# EAGLE design RS232- EIB_Router V1.0 (EAGLE 5.04)
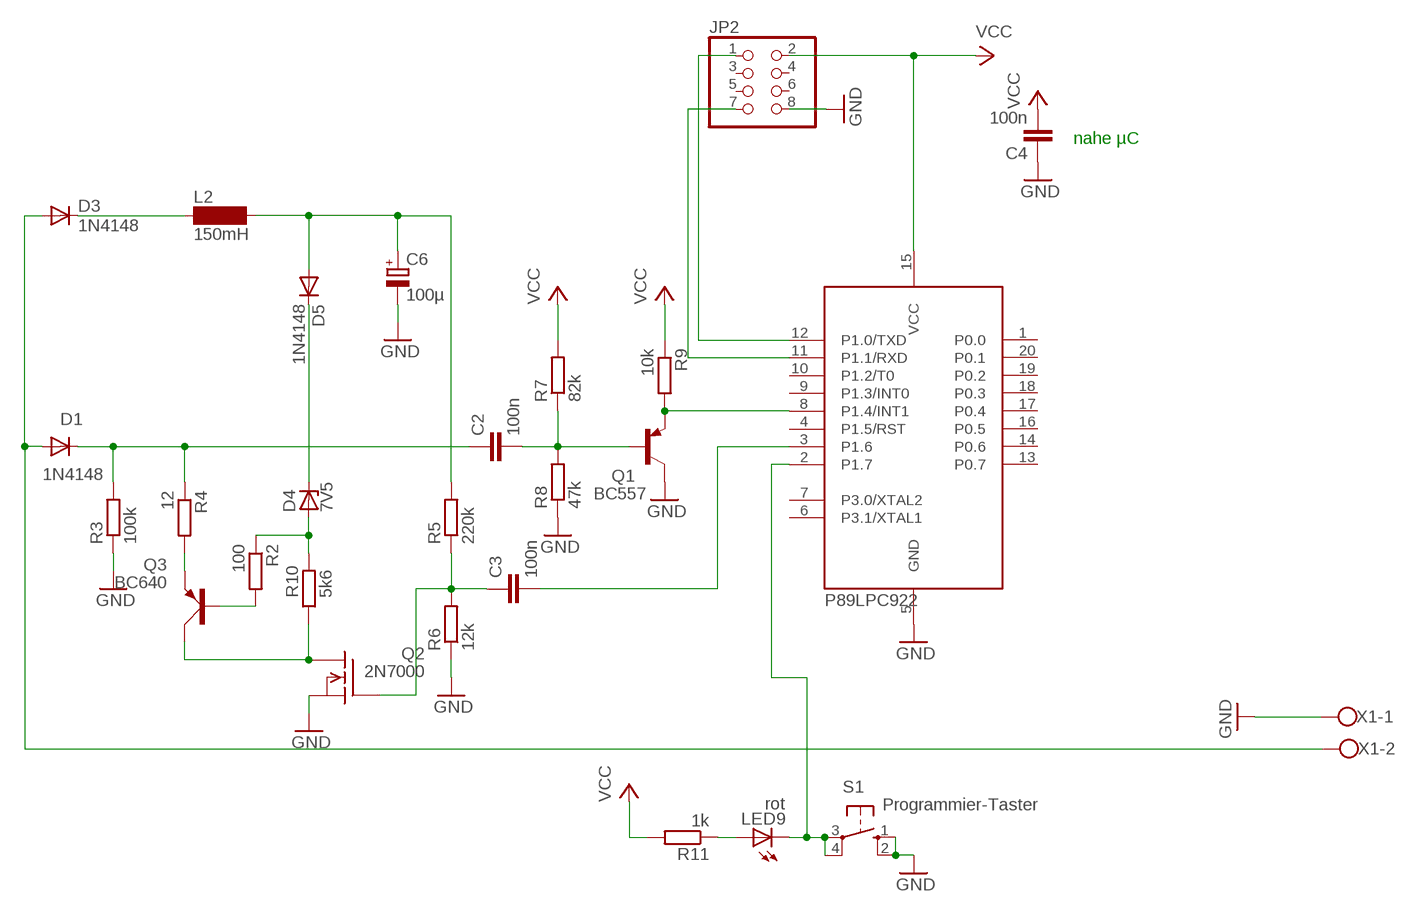
[diagram p0: schematic, sheet 1]

## Parts
C2  100n  C-EU050-024X044  [C050-024X044]
C3  100n  C-EU050-024X044  [C050-024X044]
C4  100n  C-EU050-024X044  [C050-024X044]
C6  100µ  CPOL-EUE5-8.5  [E5-8,5]
D1  1N4148  [DO35-10]
D3  1N4148  [DO35-10]
D4  7V5  ZPD  [DO35Z10]
D5  1N4148  [DO35-10]
JP2  PINHD-2X4  [2X04]
L2  150mH  SD12-1000  [SD12_1000]
LED9  rot  LED3MM  [LED3MM]
Q1  BC557  [TO92]
Q2  2N7000  VN2222KM  [TO237]
Q3  BC640  [SOT54D]
R2  100  R-EU_0207/10  [0207/10]
R3  100k  R-EU_0207/10  [0207/10]
R4  12  R-EU_0207/10  [0207/10]
R5  220k  R-EU_0207/10  [0207/10]
R6  12k  R-EU_0207/10  [0207/10]
R7  82k  R-EU_0207/10  [0207/10]
R8  47k  R-EU_0207/10  [0207/10]
R9  10k  R-EU_0207/10  [0207/10]
R10  5k6  R-EU_0207/10  [0207/10]
R11  1k  R-EU_0207/10  [0207/10]
S1  Programmier-Taster  10-XX  [B3F-10XX]
U1  89LPC922  [DIL20]
X1  W237-102  [W237-102]

## Nets
GND: C4.1 C6.- JP2.8 Q1.3(C) Q2.3(S) R3.1 R6.1 R8.1 S1.1(S) S1.2(S1) U1.5(GND) X1.1
N$1: Q1.1(E) R9.2 U1.8(P1.4/INT1)
N$2: C2.2 Q1.2(B) R7.1 R8.2
N$3: C6.+ D5.A L2.2 R5.2
N$5: C3.2 U1.3(P1.6)
N$6: Q2.1(D) Q3.C R10.1
N$8: D3.C L2.1
N$9: C2.1 D1.C R3.2 R4.1
N$11: D4.A R2.1 R10.2
N$12: Q3.E R4.2
N$14: Q3.B R2.2
N$16: D1.A D3.A X1.2
N$17: LED9.K(C) S1.3(P) S1.4(P1) U1.2(P1.7)
N$29: JP2.1 U1.12(P1.0/TXD)
N$30: JP2.7 U1.11(P1.1/RXD)
N$34: C3.1 Q2.2(G) R5.1 R6.2
N$40: D4.C D5.C
N$41: LED9.A R11.1
VCC: C4.2 JP2.2 R7.2 R9.1 R11.2 U1.15(VCC)
Unconnected: JP2.3 JP2.4 JP2.5 JP2.6 U1.1(P0.0) U1.4(P1.5/RST) U1.6(P3.1/XTAL1) U1.7(P3.0/XTAL2) U1.9(P1.3/INT0) U1.10(P1.2/T0) U1.13(P0.7) U1.14(P0.6) U1.16(P0.5) U1.17(P0.4) U1.18(P0.3) U1.19(P0.2) U1.20(P0.1)

## Notes on the sheet
- nahe µC
- P89LPC922

## Library data of the parts
C2-C4 = rcl:C-EU: CAPACITOR, European symbol
C6 = rcl:CPOL-EU: POLARIZED CAPACITOR, European symbol
D1 D3 D5 = diode:1N4148: DIODE high speed (Philips)
D4 = diode:ZPD: Z DIODE 500 mW
JP2 = pinhead:PINHD-2X4: PIN HEADER
L2 = inductor-neosid:SD12: INDUCTOR nominal inductance
LED9 = led:LED: LED OSRAM: - CHIPLED LG R971, LG N971, LY N971, LG Q971, LY Q971, LO R971, LY R971 LH N974, LH R974 LS Q976, LO Q976, LY Q976 LO Q996 - Hyper CHIPLED LW Q18S LB Q993, LB Q99A, LB R99A - SideLED LS A670, LO A670, LY A670, LG A670, LP A670 LB A673, LV A673, LT A673, LW A673 LH A674 LY A675 LS A676, LA A676, LO A676, LY A676, LW A676 LS A679, LY A679, LG A679 - Hyper Micro SIDELED® LS Y876, LA Y876, LO Y876, LY Y876 LT Y87S - SmartLED LW L88C, LW L88S LB L89C, LB L89S, LG L890 LS L89K, LO L89K, LY L89K LS L896, LA L896, LO L896, LY L896 - TOPLED LS T670, LO T670, LY T670, LG T670, LP T670 LSG T670, LSP T670, LSY T670, LOP T670, LYG T670 LG T671, LOG T671, LSG T671 LB T673, LV T673, LT T673, LW T673 LH T674 LS T676, LA T676, LO T676, LY T676, LB T676, LH T676, LSB T676, LW T676 LB T67C, LV T67C, LT T67C, LS T67K, LO T67K, LY T67K, LW E67C LS E67B, LA E67B, LO E67B, LY E67B, LB E67C, LV E67C, LT E67C LW T67C LS T679, LY T679, LG T679 LS T770, LO T770, LY T770, LG T770, LP T770 LB T773, LV T773, LT T773, LW T773 LH T774 LS E675, LA E675, LY E675, LS T675 LS T776, LA T776, LO T776, LY T776, LB T776 LHGB T686 LT T68C, LB T68C - Hyper Mini TOPLED® LB M676 - Mini TOPLED Santana® LG M470 LS M47K, LO M47K, LY M47K Source: http://www.osram.convergy.de - LUMILED® LXK2-PW12-R00, LXK2-PW12-S00, LXK2-PW14-U00, LXK2-PW14-V00 LXK2-PM12-R00, LXK2-PM12-S00, LXK2-PM14-U00 LXK2-PE12-Q00, LXK2-PE12-R00, LXK2-PE12-S00, LXK2-PE14-T00, LXK2-PE14-U00 LXK2-PB12-K00, LXK2-PB12-L00, LXK2-PB12-M00, LXK2-PB14-N00, LXK2-PB14-P00, LXK2-PB14-Q00 LXK2-PR12-L00, LXK2-PR12-M00, LXK2-PR14-Q00, LXK2-PR14-R00 LXK2-PD12-Q00, LXK2-PD12-R00, LXK2-PD12-S00 LXK2-PH12-R00, LXK2-PH12-S00 LXK2-PL12-P00, LXK2-PL12-Q00, LXK2-PL12-R00 Source: www.luxeon.com
Q1 = transistor-pnp:BC557: PNP Transistor
Q2 = transistor-fet:VN2222KM: N-Channel Enhancement MOSFET (VMOS); 60V; 0,5A; 7,5Ohm
Q3 = transistor-small-signal:BC640: PNP TRANSISTOR
R2-R11 = rcl:R-EU_: RESISTOR, European symbol
S1 = switch-omron:10-XX: OMRON SWITCH
U1 = micro-philips:89LPC922
X1 = con-wago-500:W237-102: WAGO SCREW CLAMP

## Board
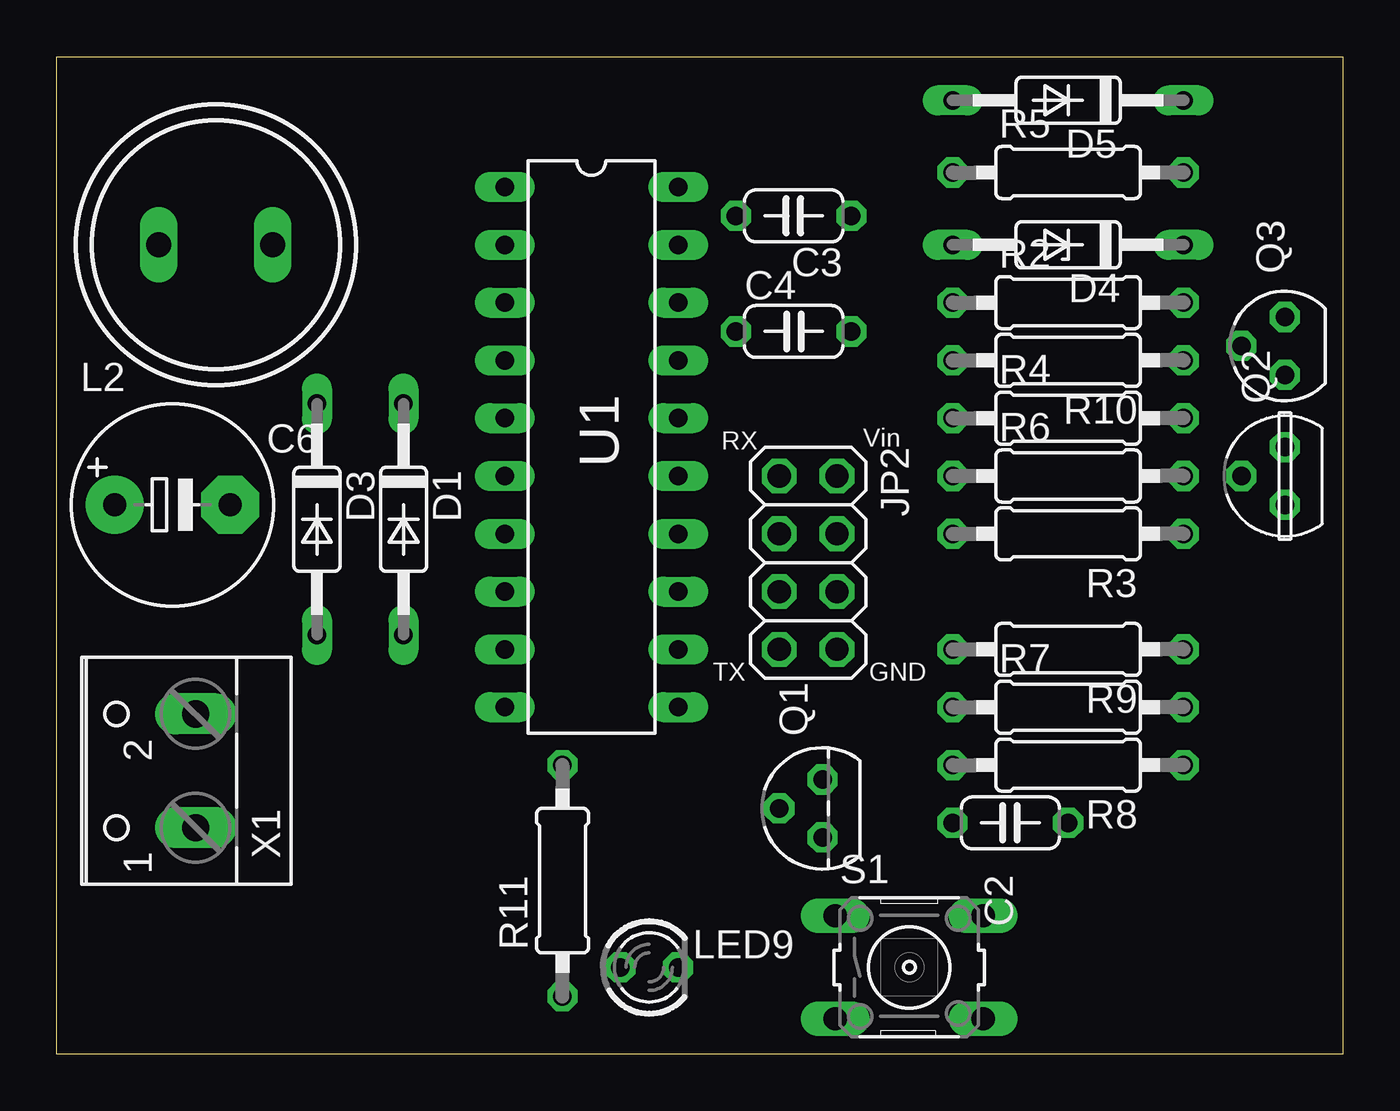
[diagram p1: board, top side]
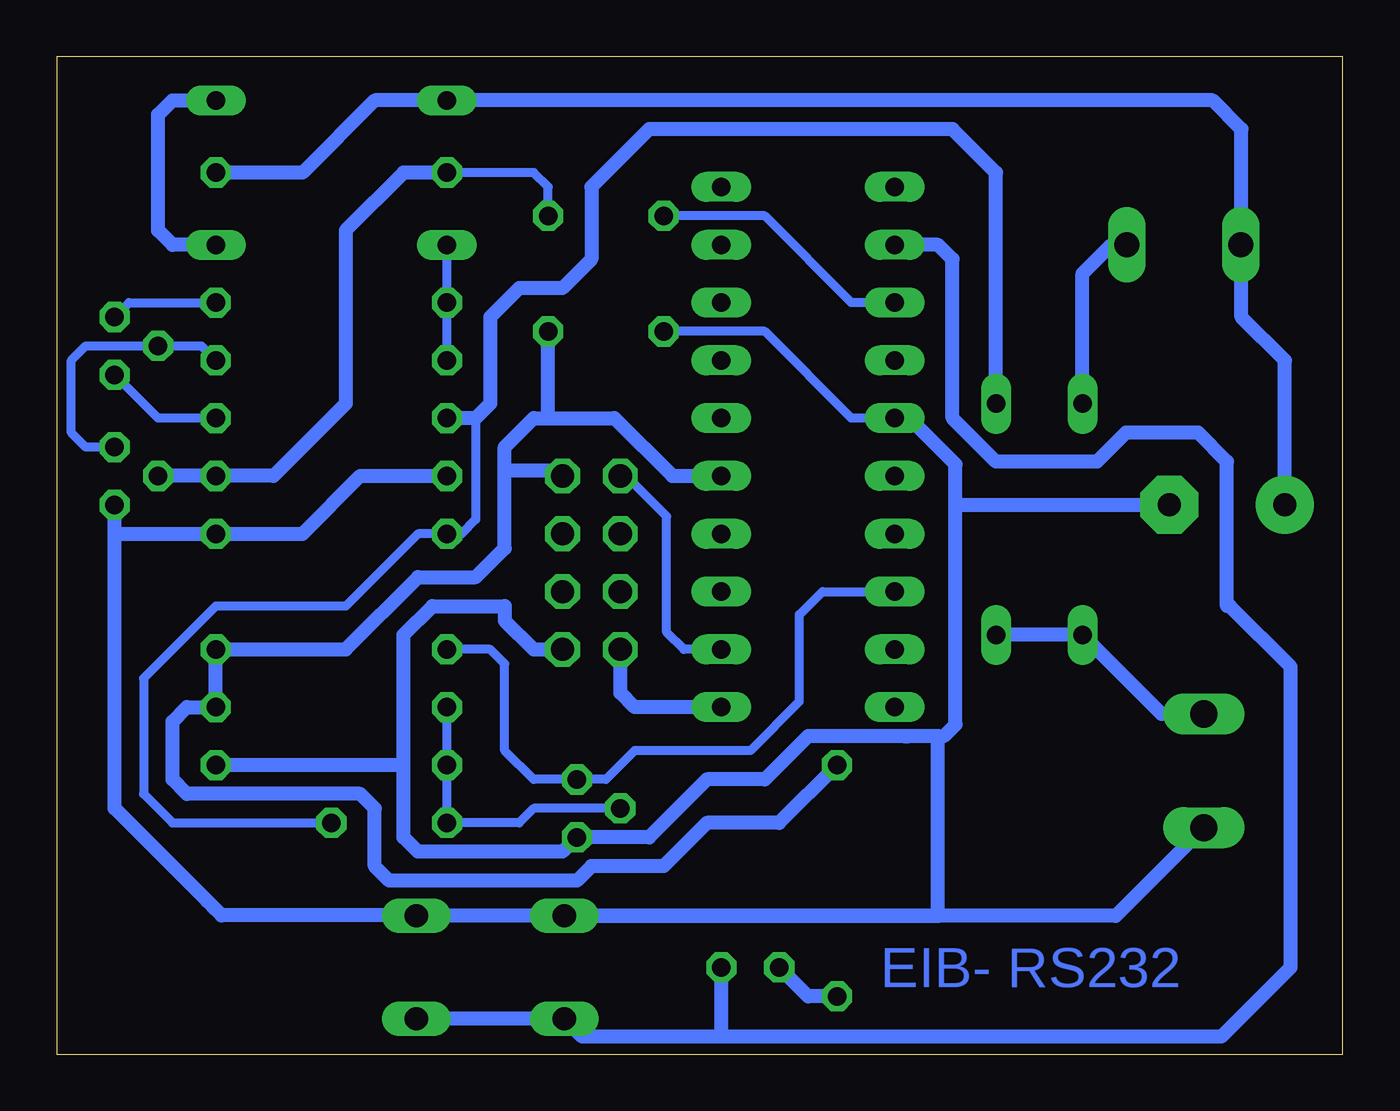
[diagram p2: board, bottom side, seen from below]

Size 56.51 x 43.81 mm. Coordinates in mm from the lower left corner, seen from the top.
Outline: 0,0 0,43.81 56.51,43.81 56.51,0 0,0
Copper layers (1*16): Top 0.035mm / dielectric 1.5mm / Bottom 0.035mm
Design rules "default *": minimum track width 10mil, minimum drill 24mil, track to track 12mil, track to pad 12mil, pad to pad 12mil, via to via 12mil, smd to smd 8mil, copper to edge 20mil, drill to drill 8mil, minimum pad ring 10mil, minimum via ring 8mil, stop-mask expansion 4mil, vias tented up to drill 0mil, thermal gap 10mil

### Footprints (pad centres in the part's own frame; a part is rotated, then mirrored left to right if it is on the bottom)
C050-024X044 = drill 0.813 octagon: 1 -2.54,0; 2 2.54,0
E5-8,5 = drill 1.016 pad 2.54 round: + -2.54,0 | drill 1.016 pad 2.54 octagon: - 2.54,0
DO35-10 = drill 0.813 long: A 5.08,0; C -5.08,0
DO35Z10 = drill 0.813 long: A 5.08,0; C -5.08,0
2X04 = drill 1.016 octagon: 1 -3.81,-1.27; 2 -3.81,1.27; 3 -1.27,-1.27; 4 -1.27,1.27; 5 1.27,-1.27; 6 1.27,1.27; 7 3.81,-1.27; 8 3.81,1.27
SD12_1000 = drill 1.1 long: 1 -2.5,0; 2 2.5,0
LED3MM = drill 0.813 octagon: A -1.27,0; K 1.27,0
TO92 = drill 0.813 octagon: 1 1.27,0; 2 0,1.905; 3 -1.27,0
TO237 = drill 0.813 octagon: 1 1.27,0; 2 0,1.905; 3 -1.27,0
SOT54D = drill 0.813 octagon: B 1.27,0; C 0,1.905; E -1.27,0
0207/10 = drill 0.813 octagon: 1 -5.08,0; 2 5.08,0
B3F-10XX = drill 1.016 long: 1 -3.251,2.261; 2 3.251,2.261; 3 -3.251,-2.261; 4 3.251,-2.261
DIL20 = drill 0.813 long: 1 -11.43,-3.81; 2 -8.89,-3.81; 3 -6.35,-3.81; 4 -3.81,-3.81; 5 -1.27,-3.81; 6 1.27,-3.81; 7 3.81,-3.81; 8 6.35,-3.81; 9 8.89,-3.81; 10 11.43,-3.81; 11 11.43,3.81; 12 8.89,3.81; 13 6.35,3.81; 14 3.81,3.81; 15 1.27,3.81; 16 -1.27,3.81; 17 -3.81,3.81; 18 -6.35,3.81; 19 -8.89,3.81; 20 -11.43,3.81
W237-102 = drill 1.194 long: 1 -2.5,-1.27; 2 2.5,-1.27

### Placement (x,y rotation side)
C2  41.91,10.16 180 top
C3  32.38,36.83 180 top
C4  32.38,31.75 0 top
C6  5.08,24.13 0 top
D1  15.24,23.5 270 top
D3  11.43,23.5 270 top
D4  44.45,35.56 180 top
D5  44.45,41.91 180 top
JP2  33.02,21.59 270 top
L2  6.99,35.56 180 top
LED9  26.04,3.81 0 top
Q1  33.65,10.79 90 top
Q2  53.97,25.4 90 top
Q3  53.97,31.11 90 top
R2  44.45,33.02 0 top
R3  44.45,22.86 180 top
R4  44.45,27.94 0 top
R5  44.45,38.73 0 top
R6  44.45,25.4 0 top
R7  44.45,15.24 0 top
R8  44.45,12.7 180 top
R9  44.45,17.78 180 top
R10  44.45,30.48 180 top
R11  22.23,7.62 90 top
S1  37.46,3.81 0 top
U1  23.5,26.67 270 top
X1  4.83,12.45 90 top

### Tracks (layer width: path | path; a pad name or v marks a point on that pad's centre or on a via)
GND
  Bottom 0.406: U1.5 21.59,27.94 25.4,31.75 C4.1
  Bottom 0.61: 41.27,12.7 41.27,9.53 40.64,8.89 34.29,8.89 Q1.3 30.48,9.53 27.94,12.06 25.4,12.06 23.5,13.97 19.3,13.97 | 41.27,12.7 41.27,18.41 40,19.68 36.83,19.68 36.83,19.05 35.56,17.78 JP2.8 | 41.27,12.7 R8.1 | 19.3,13.97 19.05,13.97 | R6.1 43.18,25.4 45.72,22.86 R3.1 53.97,22.86 | 53.97,22.86 Q2.3 | 49.91,6.73 49.53,6.35 | 49.91,6.73 53.97,10.79 53.97,22.86 | U1.5 19.05,27.94 17.02,25.91 17.02,24.13 | 17.78,13.97 17.53,13.97 17.02,14.48 17.02,24.13 | 17.78,13.97 19.3,13.97 | 17.02,24.13 C6.- | X1.1 9.97,6.07 S1.1 | S1.1 17.78,6.07 17.78,13.97 | S1.1 40.51,6.07 40.54,6.1 | 40.54,6.1 49.28,6.1 49.91,6.73 | 40.54,6.1 40.69,6.1 S1.2
N$1
  Bottom 0.406: U1.8 22.86,20.32 23.88,19.3 23.88,15.49 26.04,13.34 31.11,13.34 32.38,12.06 Q1.1 35.56,12.06 36.83,13.34 36.83,17.14 37.46,17.78 R9.2
N$2
  Bottom 0.406: Q1.2 35.56,10.79 36.2,10.16 C2.2 R8.2 R7.1
N$3
  Bottom 0.61: C6.+ 2.54,30.48 4.45,32.38 4.45,35.56 | R5.2 45.72,38.73 42.54,41.91 D5.A 5.71,41.91 4.45,40.64 4.45,35.56 | 4.45,35.56 L2.2
N$5
  Bottom 0.406: U1.3 21.59,33.02 25.4,36.83 C3.2
N$6
  Bottom 0.406: R10.1 50.16,31.11 Q3.C 55.24,31.11 55.88,30.48 55.88,27.3 55.24,26.67 Q2.1
N$8
  Bottom 0.61: D3.C 11.43,34.29 10.16,35.56 L2.1
N$9
  Bottom 0.406: C2.1 51.43,10.16 52.7,11.43 52.7,16.51 49.53,19.68 43.81,19.68 40.64,22.86 R3.2 38.73,22.86 38.1,23.5 38.1,27.94
  Bottom 0.61: D1.C 15.24,38.73 17.14,40.64 30.48,40.64 33.02,38.1 33.02,34.92 34.29,33.66 36.2,33.66 37.46,32.38 37.46,28.57 38.1,27.94 R4.1
N$11
  Bottom 0.406: D4.A R2.1 R10.2
N$12
  Bottom 0.406: R4.2 52.07,27.94 Q3.E
N$14
  Bottom 0.406: Q3.B 53.34,33.02 R2.2
N$16
  Bottom 0.61: D1.A D3.A 7.96,14.95 X1.2
N$17
  Bottom 0.61: 34.29,1.55 S1.3 33.43,0.76 27.43,0.76 | 34.29,1.55 S1.4 | 34.29,1.55 34.29,1.27 | U1.2 17.78,35.56 17.14,34.92 17.14,27.94 15.24,26.04 10.79,26.04 9.53,27.3 6.35,27.3 5.08,26.04 5.08,19.68 4.95,19.68 2.29,17.02 2.29,3.81 5.33,0.76 27.43,0.76 | LED9.K 27.3,0.89 27.43,0.76
N$29
  Bottom 0.406: U1.12 28.96,17.78 29.72,18.54 29.72,23.62 31.5,25.4 JP2.1
N$30
  Bottom 0.61: U1.11 31.11,15.24 31.75,15.88 JP2.7
N$34
  Bottom 0.406: C3.1 34.92,38.1 35.56,38.73 R5.1
  Bottom 0.61: R5.1 41.27,38.73 43.81,36.2 43.81,28.57 46.99,25.4 R6.2 Q2.2
N$40
  Bottom 0.61: D4.C 51.43,35.56 52.07,36.2 52.07,41.27 51.43,41.91 D5.C
N$41
  Bottom 0.61: R11.1 23.5,2.54 LED9.A
VCC
  Bottom 0.61: 36.83,25.65 36.83,22.23 38.1,20.95 40.64,20.95 43.81,17.78 R9.1 R7.2 50.8,15.24 51.43,14.61 51.43,12.06 50.8,11.43 43.18,11.43 42.54,10.79 42.54,8.26 41.91,7.62 33.65,7.62 33.02,8.26 29.84,8.26 27.94,10.16 24.77,10.16 R11.2 | 36.83,25.65 36.83,26.67 35.56,27.94 34.92,27.94 | 34.92,27.94 C4.2 | 34.92,27.94 32,27.94 29.46,25.4 U1.15 | JP2.2 34.54,25.65 36.83,25.65

### Text on the board
Bottom: EIB- RS232
tPlace: RX | Vin | TX | GND